# Altium schematic sheet usb-uart-nano.SchDoc: Активная радиометка
size 420 x 297 mm; ApprovedBy: Ефимов; CheckedBy: Поважаев; Author: Журавлёв; CompanyName: ООО"СМАРТДАЙВ"; DocumentNumber: ВРТН.421453.013 Э3; SheetNumber: 1; SheetTotal: 1; PageSetup: Record=PageOptions|CenterHorizontal=True|CenterVertical=True|PrintScale=1.00|XCorrection=1.00|YCorrection=1.00|PrintKind=1|BorderSize=5000000|LeftOffset=0|BottomOffset=0|Orientation=2|PaperLength=1000|PaperWidth=1000|Scale=100|PaperSource=15|PrintQuality=1200|MediaType=1|DitherType=10|PaperKind=A3|PrintScaleMode=1; Weight: -; ScaleFactor: -
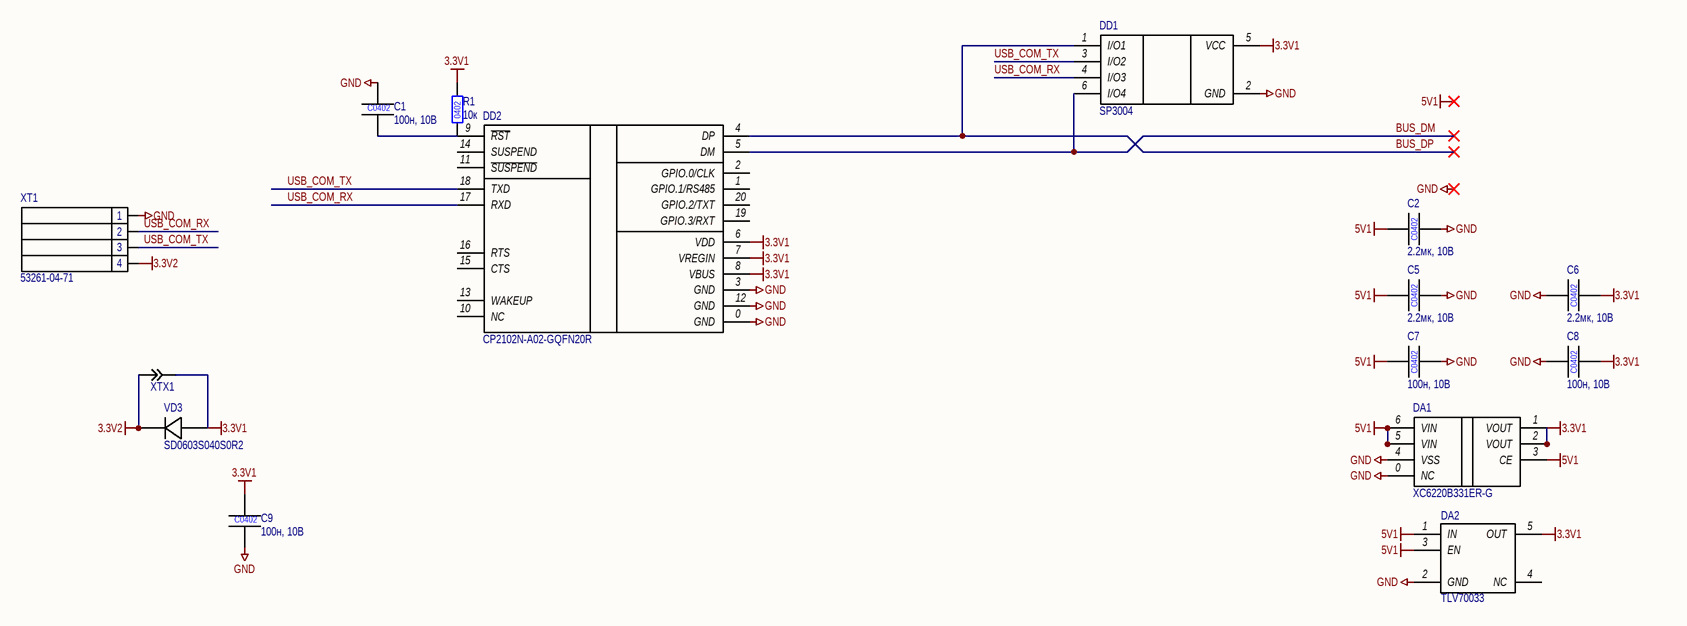
[diagram p0: usb-uart-nano.SchDoc]

## Parts
C1  C0402  value 100н, 10В  [C0402]
C2  C0402  value 2.2мк, 10В  [C0402]
C5  C0402  value 2.2мк, 10В  [C0402]
C6  C0402  value 2.2мк, 10В  [C0402]
C7  C0402  value 100н, 10В  [C0402]
C8  C0402  value 100н, 10В  [C0402]
C9  C0402  value 100н, 10В  [C0402]
DA1  XC6220B331ER-G  [LDO_DFN-6(1.8x2)]
DA2  TLV70033  [SC-70-5N]
DD1  SP3004  [ESD_SOT563]
DD2  CP2102N-A02-GQFN20R  [I_QFN-20_3x3]
R1  value 10к  [R0402]  (hidden comment: R0402)
VD3  SD0603S040S0R2  [0603_DIOD]
XT1  53261-04-71  [53261-04-71]
XTX1  Solder bridge 0603  [Solder Bridge 0603]  (value not drawn)

## Nets
3.3V1: C6.2(-) C8.2(-) C9.1(+) DA1.1(VOUT) DA1.2(VOUT) DA2.5(OUT) DD1.5(VCC) DD2.6(VDD) DD2.7(VREGIN) DD2.8(VBUS) R1.2 VD3.2(Анод) XTX1.1
3.3V2: VD3.1(Катод) XT1.4 XTX1.2
5V1: C2.1(+) C5.1(+) C7.1(+) DA1.3(CE) DA1.5(VIN) DA1.6(VIN) DA2.1(IN) DA2.3(EN)
GND: C1.1(+) C2.2(-) C5.2(-) C6.1(+) C7.2(-) C8.1(+) C9.2(-) DA1.0(NC) DA1.4(VSS) DA2.2(GND) DD1.2(GND) DD2.0(GND) DD2.3(GND) DD2.12(GND) XT1.1
BUS_DM: DD1.6(I/O4) DD2.5(DM)
BUS_DP: DD1.1(I/O1) DD2.4(DP)
USB_COM_RX: DD1.4(I/O3) DD2.17(RXD) XT1.2
USB_COM_TX: DD1.3(I/O2) DD2.18(TXD) XT1.3
NetC1_2: C1.2(-) DD2.9(~{RST}) R1.1

Not connected (* = marked no-connect by the designer): DA2 4(NC); DD2 1(GPIO.1/RS485) 2(GPIO.0/CLK) 10(NC) 11(~{SUSPEND}) 13(WAKEUP) 14(SUSPEND) 15(CTS) 16(RTS) 19(GPIO.3/RXT) 20(GPIO.2/TXT)

## Notes on the sheet
- Labels drawn without touching a wire or pin: 5V1, GND
- Перв. примен.
- Справ. №
- ПЗ:                             Дата
- Подп. и дата
- Инв. № дубл.
- Взам. инв. №
- Разраб.
- Изм.
- Лист
- № докум.
- Подп.
- Дата
- Литера
- Масса
- Масштаб
- Пров.
- Т.контр.
- Схема электрическая принципиальная
- Листов
- Инв. № подл.
- Н.контр.
- Утв.
- Форма 1 ГОСТ 2.104-2006
- Копировал
- Формат А3

## Library data of the parts
C1 C2 C5-C9 = C0402: Конденсатор керамический; Name: Конденсатор керамический 0402; FP_TS: 0402; ComponentLink1Description: Datasheet; ComponentLink1URL: *; ComponentLink2Description: Shop; ComponentLink2URL: *; Мanufacturer: *
DA1 = XC6220B331ER-G: Стабилизатор напряжения 3.3; Мanufacturer: Torex Semicon; Name: XC6220B331ER-G; ComponentLink1Description: Datasheet; ComponentLink1URL: https://www.lcsc.com/datasheet/lcsc_datasheet_2410121540_Torex-Semicon-XC6220B331ER-G_C3013657.pdf; ComponentLink2Description: Shop; ComponentLink2URL: https://www.lcsc.com/product-detail/Voltage-Regulators-Linear-Low-Drop-Out-LDO-Regulators_Torex-Semicon-XC6220B331ER-G_C3013657.html?s_z=n_LP38692SD-3.3; Value: XC6220B331ER-G; JLCPART: C3013657
DA2 = TLV70033: Стабилизатор напряжения 3.3В, с управлением; Name: Стабилизатор TLV70033; Мanufacturer: Texas Instruments; ComponentLink1Description: Datasheet; ComponentLink1URL: http://www.ti.com/lit/ds/symlink/tlv700-q1.pdf; ComponentLink2Description: Shop; ComponentLink2URL: https://www.digikey.com/product-detail/en/texas-instruments/TLV70033DDCR/296-27937-1-ND/2440840; Value: TLV70033
DD1 = SP3004: Защитные диоды 4 канала+питание; Name: SP3004; ComponentLink1Description: Datasheet; ComponentLink1URL: *; ComponentLink2Description: Shop; ComponentLink2URL: *; Value: *; Мanufacturer: *; JLCPART: C207280
DD2 = CP2102N-A02-GQFN20R: USB/UART мост; Manufacturer: Silicon Labs; Name: CP2102N-A02-GQFN20R; ComponentLink1Description: Datasheet; ComponentLink1URL: https://www.silabs.com/documents/public/data-sheets/cp2102n-datasheet.pdf; ComponentLink2Description: Shop; ComponentLink2URL: https://www.lcsc.com/product-detail/USB-Converters_SKYWORKS-SILICON-LABS-CP2102N-A02-GQFN20R_C969913.html?s_z=n_CP2102N-A01-GQFN2; Value: *; JLCPART: C969913
R1 = R0402: Чип-Резистор; Name: Чип-резистор 0402; ComponentLink1Description: Datasheet; ComponentLink1URL: *; ComponentLink2Description: Shop; ComponentLink2URL: *; Мanufacturer: *; Footprint_label: 0402
VD3 = SD0603S040S0R2: Диод Шоттки 0.2А, 40В; Мanufacturer: AVX; ComponentLink1Description: Datasheet; ComponentLink1URL: http://datasheets.avx.com/schottky.pdf; ComponentLink2Description: Shop; ComponentLink2URL: https://www.digikey.com/product-detail/en/avx-corporation/SD0603S040S0R2/478-7798-1-ND/3749483; Name: SD0603S040S0R2; Value: *; JLCPART: C3758192
XT1 = 53261-04-71: Вилка на плату угловая; Мanufacturer: Molex; ComponentLink1Description: Datasheet; ComponentLink1URL: https://www.molex.com/content/dam/molex/molex-dot-com/products/automated/en-us/salesdrawingpdf/532/53261/532610671_sd.pdf?inline; ComponentLink2Description: Shop; ComponentLink2URL: https://www.lcsc.com/product-detail/Wire-To-Board-Connector_MOLEX-532610471_C696092.html; Name: 53261-04-71; Value: *; JLCPART: C240847
XTX1 = Solder bridge 0603: Паяемая перемычка 0603; ComponentLink1Description: Datasheet; ComponentLink1URL: *; ComponentLink2Description: Shop; ComponentLink2URL: *; Name: Solder bridge 0603; Value: *; Мanufacturer: *